# Altium schematic sheet Power.SchDoc
size A4; SheetNumber: 8
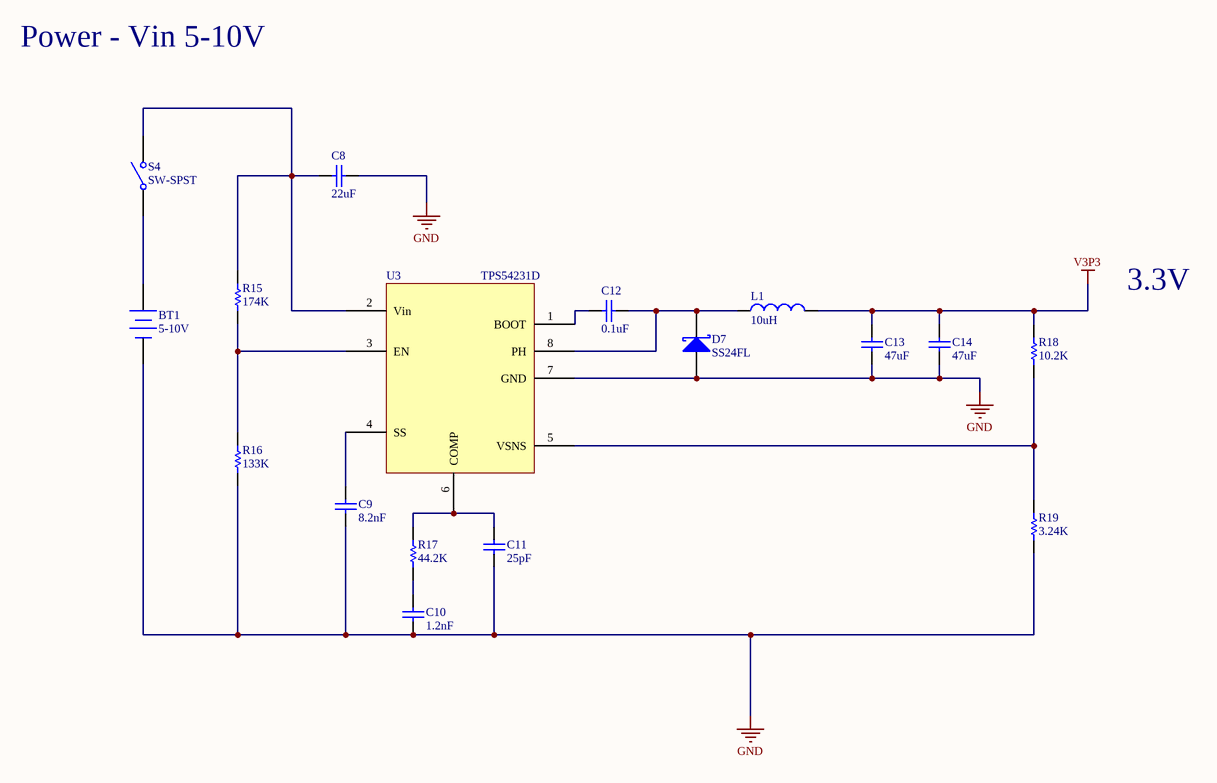
[diagram p0: Power.SchDoc]

## Parts
BT1  5-10V  [BAT-2]
C8  22uF  [own_0603]
C9  8.2nF  [own_0603]
C10  1.2nF  [own_0603]
C11  25pF  [own_0603]
C12  0.1uF  [own_0603]
C13  47uF  [Own_0805]
C14  47uF  [Own_0805]
D7  SS24FL  [ShotkyCMS]
L1  10uH  [Inductor CMS]
R15  174K  [own_0603]
R16  133K  [own_0603]
R17  44.2K  [own_0603]
R18  10.2K  [own_0603]
R19  3.24K  [own_0603]
S4  SW-SPST  [SPST-2]
U3  TPS54231D  [R-PDSO-G8]

## Nets
GND: BT1.2(-) C8.2 C9.1 C10.1 C11.1 C13.1 C14.1 D7.2(A) R16.2 R19.2 U3.7(GND)
V3P3: C13.2 C14.2 L1.2 R18.1
NetBT1_1: BT1.1(+) S4.1(COMMON)
NetC8_1: C8.1 R15.1 S4.2(NO) U3.2(Vin)
NetC9_2: C9.2 U3.4(SS)
NetC10_2: C10.2 R17.2
NetC11_2: C11.2 R17.1 U3.6(COMP)
NetC12_1: C12.1 D7.1(K) L1.1 U3.8(PH)
NetC12_2: C12.2 U3.1(BOOT)
NetR15_2: R15.2 R16.1 U3.3(EN)
NetR18_2: R18.2 R19.1 U3.5(VSNS)

## Notes on the sheet
- Power - Vin 5-10V
- 3.3V

## Library data of the parts
BT1 = Battery: 4xAA
C8 = Cap: Capacitor; Fabricant: MURATA; RefFabricant: GRM188R61A226ME15D; Fournisseur: Farnell; RefFournisseur: 2666496; Value: 22uF
C9 = Cap: Capacitor; Fournisseur: Farnell; Fabricant: MULTICOMP; RefFabricant: MC0603B822K500CT; RefFournisseur: 1759101; Value: 8.2nF
C10 = Cap: Capacitor; RefFabricant: 0603B122K500CT; Fabricant: Walsin; Fournisseur: Farnell; RefFournisseur: 2524822; Value: 1.2nF
C11 = Cap: Capacitor; Fabricant: WALSIN; RefFabricant: 0603N250J500CT; Fournisseur: Farnell; RefFournisseur: 2524884; Value: 25pF
C12 = Cap: Capacitor; RefFabricant: 0603YC104KAZ2A; RefFournisseur: 7569556; Fabricant: AVX; Fournisseur: Farnell; Value: 0.1uF
C13 C14 = Cap: Capacitor; RefFabricant: GRM21BR60J476ME15L; Fournisseur: Farnell; Fabricant: MURATA; RefFournisseur: 2362109; Value: 47uF
D7 = Diode 10TQ035: Schottky Rectifier; Fabricant: ON SEMICONDUCTOR; Fournisseur: Farnell; RefFournisseur: 2822566; RefFabricant: SS24FL
L1 = Inductor: Fabricant: BOURNS; RefFabricant: SRN8040-100M; Fournisseur: Farnell; RefFournisseur: 2061669; Value: 10uH
R15 = Res1: Resistor; Fabricant: VISHAY; Fournisseur: Farnell; RefFabricant: CRCW0603174KFKEA; RefFournisseur: 2138522; Value: 174K
R16 = Res1: Resistor; Fabricant: MULTICOMP; Fournisseur: Farnell; RefFabricant: MCWR06X1333FTL; RefFournisseur: 2694713; Value: 133K
R17 = Res1: Resistor; Fabricant: VISHAY; Fournisseur: Farnell; RefFabricant: CRCW060344K2FKEA; RefFournisseur: 2138466; Value: 44.2K
R18 = Res1: Resistor; Fournisseur: Farnell; Fabricant: PANASONIC ELECTRONIC COMPONENTS; RefFabricant: ERJ3EKF1022V; RefFournisseur: 2059407; Value: 10.2K
R19 = Res1: Resistor; Fournisseur: Farnell; Fabricant: VISHAY; RefFabricant: CRCW06033K24FKEA; RefFournisseur: 1652877; Value: 3.24K
S4 = SW-SPST: Single-Pole, Single-Throw Switch; RefFabricant: H8600VBAAA; Fabricant: Arcolectric; Fournisseur: Farnell; RefFournisseur: 151133
U3 = TPS54231D: Buck SD 3.3V; Fabricant: Texas Instruments; Fournisseur: Farnell; RefFournisseur: 2854681; RefFabricant: TPS54231D